# Altium schematic sheet Environment_Monitor.SchDoc: Environment Monitor
size A4; DrawnBy: T Barrett; SheetNumber: 1; SheetTotal: 3
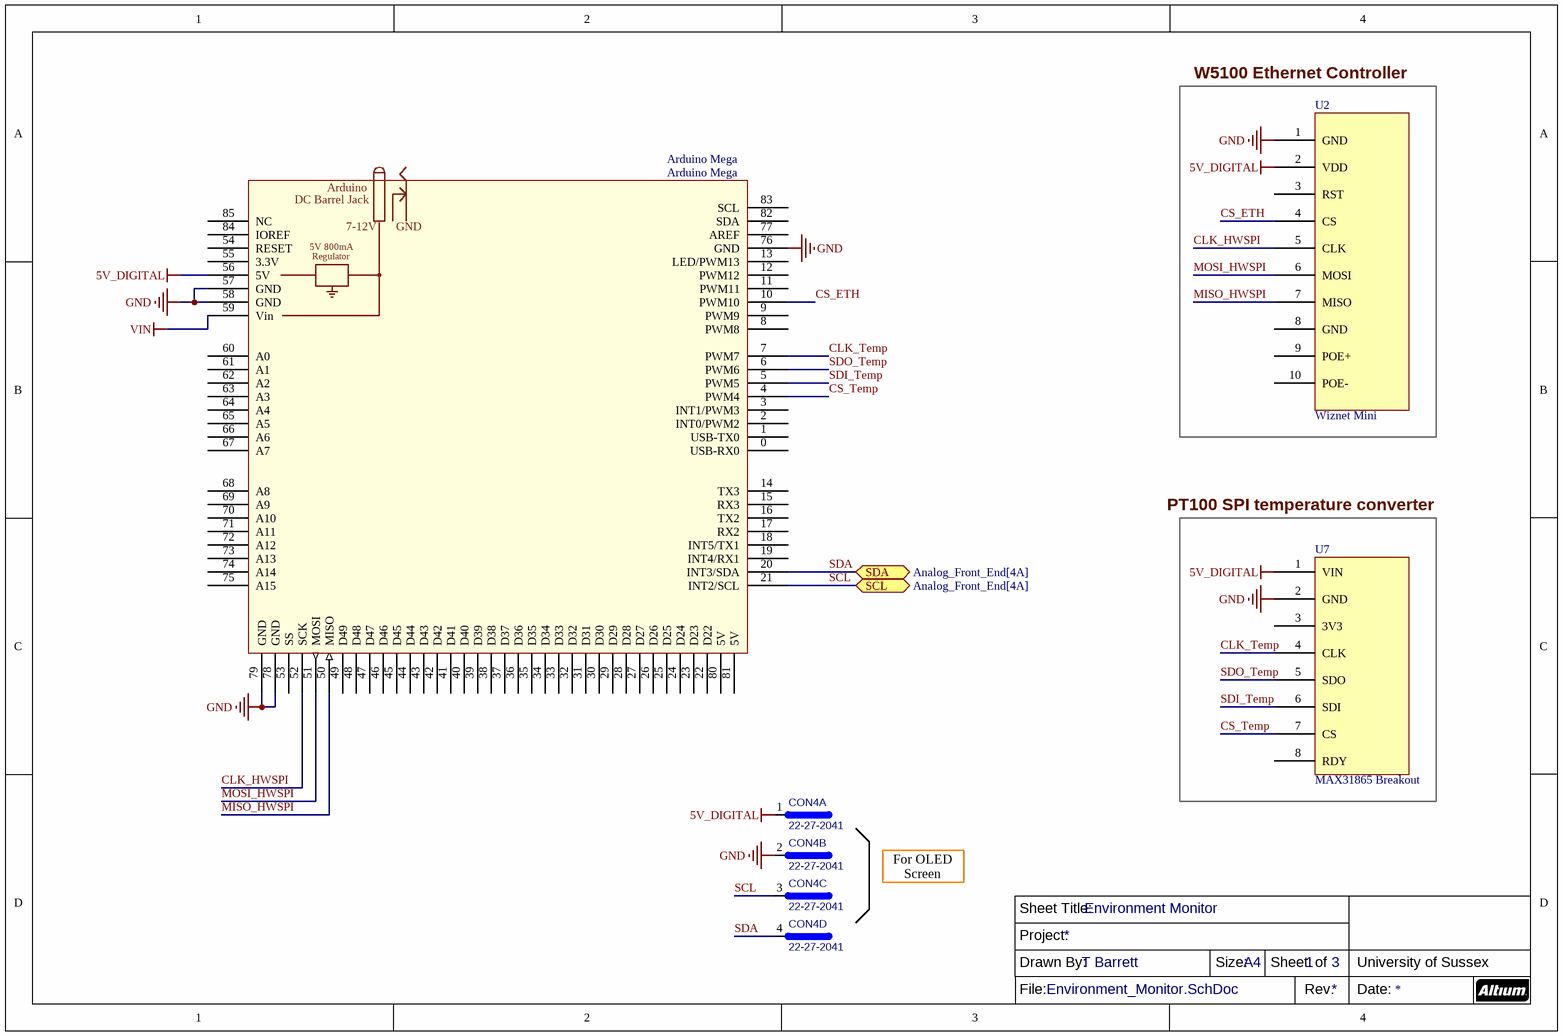
[diagram p0: Environment_Monitor.SchDoc]

## Parts
Arduino_Mega  Arduino Mega  [Arduino Mega]
CON4  22-27-2041  [22-27-2041]  (parts A,B,C,D of 4)
U2  Wiznet Mini  [Wiznet Mini W5100 Ethernet Breakout Board]
U7  MAX31865 Breakout  [MAX31865 Breakout]

## Blocks framed on the sheet
W5100 Ethernet Controller: U2
PT100 SPI temperature converter: U7

## Ports
SCL (bidir, see Analog_Front_End[4A]), SDA (bidir, see Analog_Front_End[4A])

## Nets
5V_DIGITAL: Arduino_Mega.56(5V) CON4.1 U2.2(VDD) U7.1(VIN)
GND: Arduino_Mega.57(GND) Arduino_Mega.58(GND) Arduino_Mega.76(GND) Arduino_Mega.78(GND) Arduino_Mega.79(GND) CON4.2 U2.1(GND) U7.2(GND)
VIN: Arduino_Mega.59(Vin)
CLK_HWSPI: Arduino_Mega.52(SCK) U2.5(CLK)
CLK_Temp: Arduino_Mega.7(PWM7) U7.4(CLK)
CS_ETH: Arduino_Mega.10(PWM10) U2.4(CS)
CS_Temp: Arduino_Mega.4(PWM4) U7.7(CS)
MISO_HWSPI: Arduino_Mega.50(MISO) U2.7(MISO)
MOSI_HWSPI: Arduino_Mega.51(MOSI) U2.6(MOSI)
SCL: Arduino_Mega.21(INT2/SCL) CON4.3 ; port SCL
SDA: Arduino_Mega.20(INT3/SDA) CON4.4 ; port SDA
SDI_Temp: Arduino_Mega.5(PWM5) U7.6(SDI)
SDO_Temp: Arduino_Mega.6(PWM6) U7.5(SDO)

Not connected (* = marked no-connect by the designer): Arduino_Mega 0(USB-RX0) 1(USB-TX0) 2(INT0/PWM2) 3(INT1/PWM3) 8(PWM8) 9(PWM9) 11(PWM11) 12(PWM12) 13(LED/PWM13) 14(TX3) 15(RX3) 16(TX2) 17(RX2) 18(INT5/TX1) 19(INT4/RX1) 22(D22) 23(D23) 24(D24) 25(D25) 26(D26) 27(D27) 28(D28) 29(D29) 30(D30) 31(D31) 32(D32) 33(D33) 34(D34) 35(D35) 36(D36) 37(D37) 38(D38) 39(D39) 40(D40) 41(D41) 42(D42) 43(D43) 44(D44) 45(D45) 46(D46) 47(D47) 48(D48) 49(D49) 53(SS) 54(RESET) 55(3.3V) 60(A0) 61(A1) 62(A2) 63(A3) 64(A4) 65(A5) 66(A6) 67(A7) 68(A8) 69(A9) 70(A10) 71(A11) 72(A12) 73(A13) 74(A14) 75(A15) 77(AREF) 80(5V) 81(5V) 82(SDA) 83(SCL) 84(IOREF) 85(NC); U2 3(RST) 8(GND) 9(POE+) 10(POE-); U7 3(3V3) 8(RDY)

## Notes on the sheet
- For OLED Screen
- Sheet Title:
- Drawn By:
- Project:
- Size:
- A4
- Sheet:
- of
- University of Sussex
- File:
- Rev.
- Date:
- (in symbol Arduino Mega) Arduino; DC Barrel Jack; 7-12V; 5V 800mA; Regulator

## Library data of the parts
U2 = Wiznet Mini: Wiznet W5100 Ethernet Breakout Board
U7 = MAX31865 Breakout: MAX31865 PT100 Amplifier Breakout
CON4 = 22-27-2041: Value: *